# Altium schematic sheet PP4_LCD.SchDoc
size 149 x 100 mm
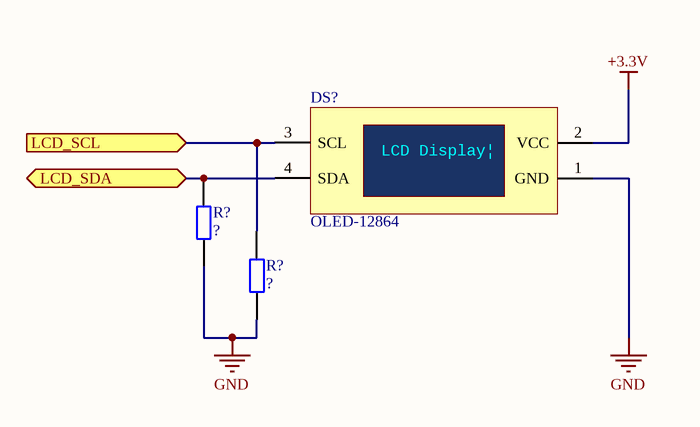
[diagram p0: PP4_LCD.SchDoc]

## Parts
(Parts that share a designator on the sheet are numbered #1, #2 ... from top to bottom, then left to right.)
DS?  OLED-12864
R?#1  Res  (value not drawn)  (no BOM)
R?#2  Res  (value not drawn)  (no BOM)

## Ports
LCD_SCL (in), LCD_SDA (bidir)

## Nets
+3.3V: DS?.2(VCC)
GND: DS?.1(GND) R?#1.1 R?#2.1
LCD_SCL: DS?.3(SCL) R?#2.2 ; port LCD_SCL
LCD_SDA: DS?.4(SDA) R?#1.2 ; port LCD_SDA

## Notes on the sheet
- (in symbol OLED-12864) LCD Display|

## Library data of the parts
DS? = OLED-12864: Ecran LCD 0.96" 128x64pix; Fabricant: Vishay; RefFabricant: OLED-12864; DataSheet: https://www.vishay.com/docs/37902/oled128o064dbpp3n00000.pdf; Tutorial: https://cdn-learn.adafruit.com/downloads/pdf/monochrome-oled-breakouts.pdf
R?#1 R?#2 = Res: Résistance; Valeur: ?